# EAGLE schematic ATSAM_motor (EAGLE 9.1.0)
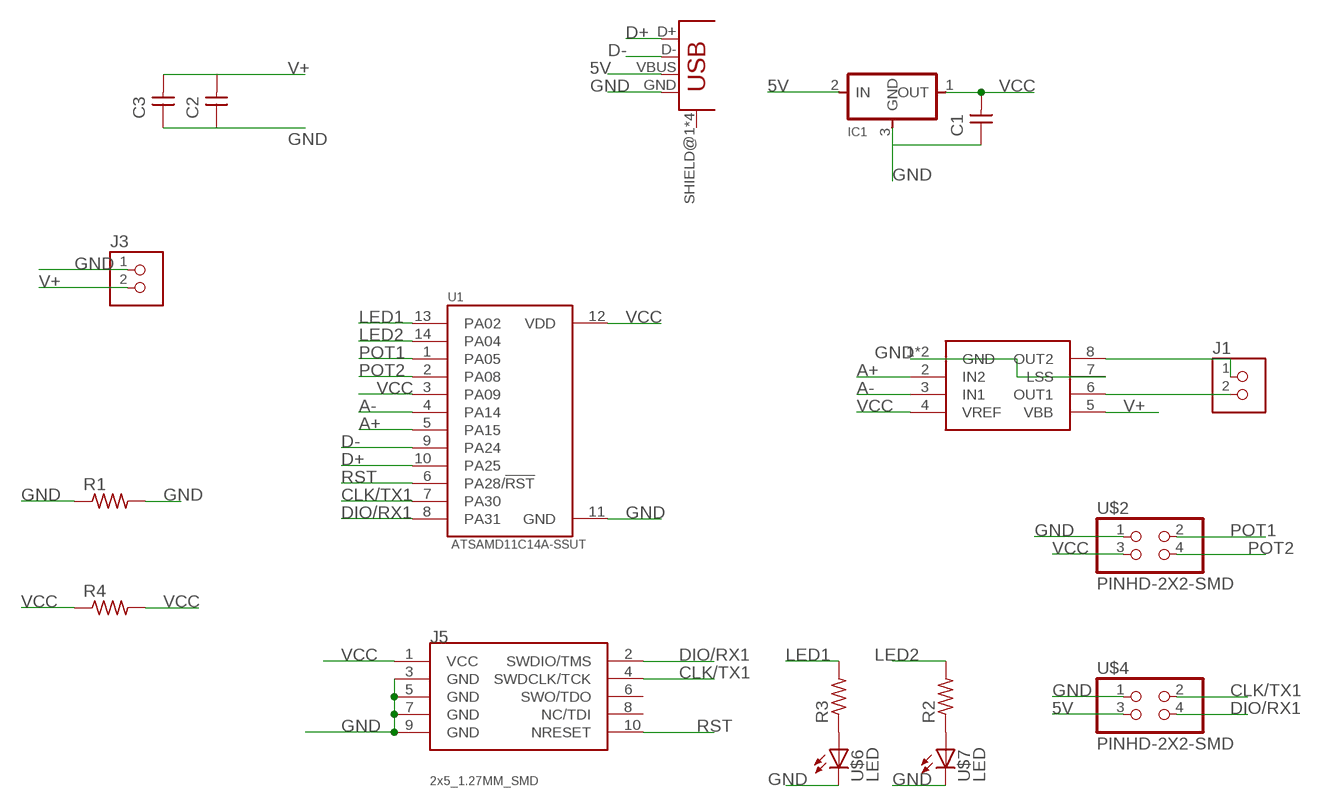
[diagram p0: schematic, sheet 1]

## Parts
C1  CAP-UNPOLARIZED  [C1206]
C2  CAP-UNPOLARIZED  [C1206]
C3  CAP-UNPOLARIZED  [C1206]
IC1  VR_REGULATOR-SOT23SOT23  [SOT23]
J1  TERM-1X02-FABLAB  [ED555DS-2DS]
J3  TERM-1X02-FABLAB  [ED555DS-2DS]
J5  CONN_05X2_ARM_DEBUGSMD  [2X5_1.27MM_SMD]
R1  R1206  [R1206]
R2  RES-US1206  [R1206]
R3  RES-US1206  [R1206]
R4  R1206  [R1206]
U1  ATSAMD11C14A-SSUT  [SOIC127P600X160-14N]
U$1  CONN_USB_MINIB  [USB_MINIB]
U$2  PINHD-2X2-SMD  [2X02SMD]
U$3  A4953-H-BRIDGE-MOTOR-DRIVER-PAD  [SOIC8_PAD]
U$4  PINHD-2X2-SMD  [2X02SMD]
U$6  LED  [LED1206]
U$7  LED  [LED1206]

## Nets
5V: IC1.2(IN) U$1.VBUS U$4.3
A+: U1.5(PA15) U$3.2(IN2)
A-: U1.4(PA14) U$3.3(IN1)
CLK/TX1: J5.4(SWDCLK/TCK) U1.7(PA30) U$4.2
D+: U1.10(PA25) U$1.D+
D-: U1.9(PA24) U$1.D-
DIO/RX1: J5.2(SWDIO/TMS) U1.8(PA31) U$4.4
GND: C1.1 C2.1 C3.1 IC1.3(GND) J3.1 J5.3(GND) J5.5(GND) J5.7(GND) J5.9(GND) R1.1 R1.2 U1.11(GND) U$1.GND U$2.1 U$3.1(GND) U$3.7(LSS) U$3.GND U$4.1 U$6.2(C) U$7.2(C)
LED1: R3.2 U1.13(PA02)
LED2: R2.2 U1.14(PA04)
N$5: R2.1 U$7.1(A)
N$12: J1.1 U$3.8(OUT2)
N$13: J1.2 U$3.6(OUT1)
N$16: R3.1 U$6.1(A)
POT1: U1.1(PA05) U$2.2
POT2: U1.2(PA08) U$2.4
RST: J5.10(NRESET) U1.6(PA28/!RST)
V+: C2.2 C3.2 J3.2 U$3.5(VBB)
VCC: C1.2 IC1.1(OUT) J5.1(VCC) R4.1 R4.2 U1.3(PA09) U1.12(VDD) U$2.3 U$3.4(VREF)
Unconnected: J5.6(SWO/TDO) J5.8(NC/TDI) U$1.SHIELD@1(SHIELD) U$1.SHIELD@2(SHIELD) U$1.SHIELD@3(SHIELD) U$1.SHIELD@4(SHIELD)

## Library data of the parts
C1-C3 = fab:CAP-UNPOLARIZED
IC1 = fab:VR_REGULATOR-SOT23
J1 J3 = fab:TERM-1X02: 3.5mm terminal block, 2 positions ED555-2DS as found in the fablab inventory. Stolen from Adafruit <http://www.ladyada.net/library/pcb/eaglelibrary.html>, adapted by Zaerc.
J5 = modified_sam:CONN_05X2_ARM_DEBUG; PACKAGE: 2x5_1.27MM_SMD
R1 R4 = fab:R: Resistor (US Symbol) Variants with postfix FAB are widened to allow the routing of internal traces
R2 R3 = fab:RES-US: Resistor (US Symbol) Variants with postfix FAB are widened to allow the routing of internal traces
U1 = ATSAMD11C14A-SSUT:ATSAMD11C14A-SSUT: MCU 32-Bit SAM D11 ARM Cortex M0+ RISC 16KB Flash 1.8V/2.5V/3.3V 14-Pin SOIC T/R; AVAILABILITY: Unavailable; DESCRIPTION: Cortex-M0+, 16KB FLASH, 4KB SRAM, USB - 14 SOIC, INDUSTRIAL, GREEN, 1.6-3.6V, 48MHz/ SOIC .150 _SS_; MF: Microchip; MP: ATSAMD11C14A-SSUT; PACKAGE: SOIC-14 Microchip; PRICE: None
U$1 = fab:CONN_USB_MINIB
U$2 U$4 = fab:PINHD-2X2-SMD
U$3 = fab:A4953-H-BRIDGE-MOTOR-DRIVER-PAD
U$6 U$7 = fab:LED: LED